# Altium schematic sheet radio.SchDoc
size A4; Organization: Altium Limited; Address1: L3, 12a Rodborough Rd; Address2: Frenchs Forest; Address3: NSW; Address4: Australia 2086; DocumentNumber: 5; SheetNumber: 5; SheetTotal: 7
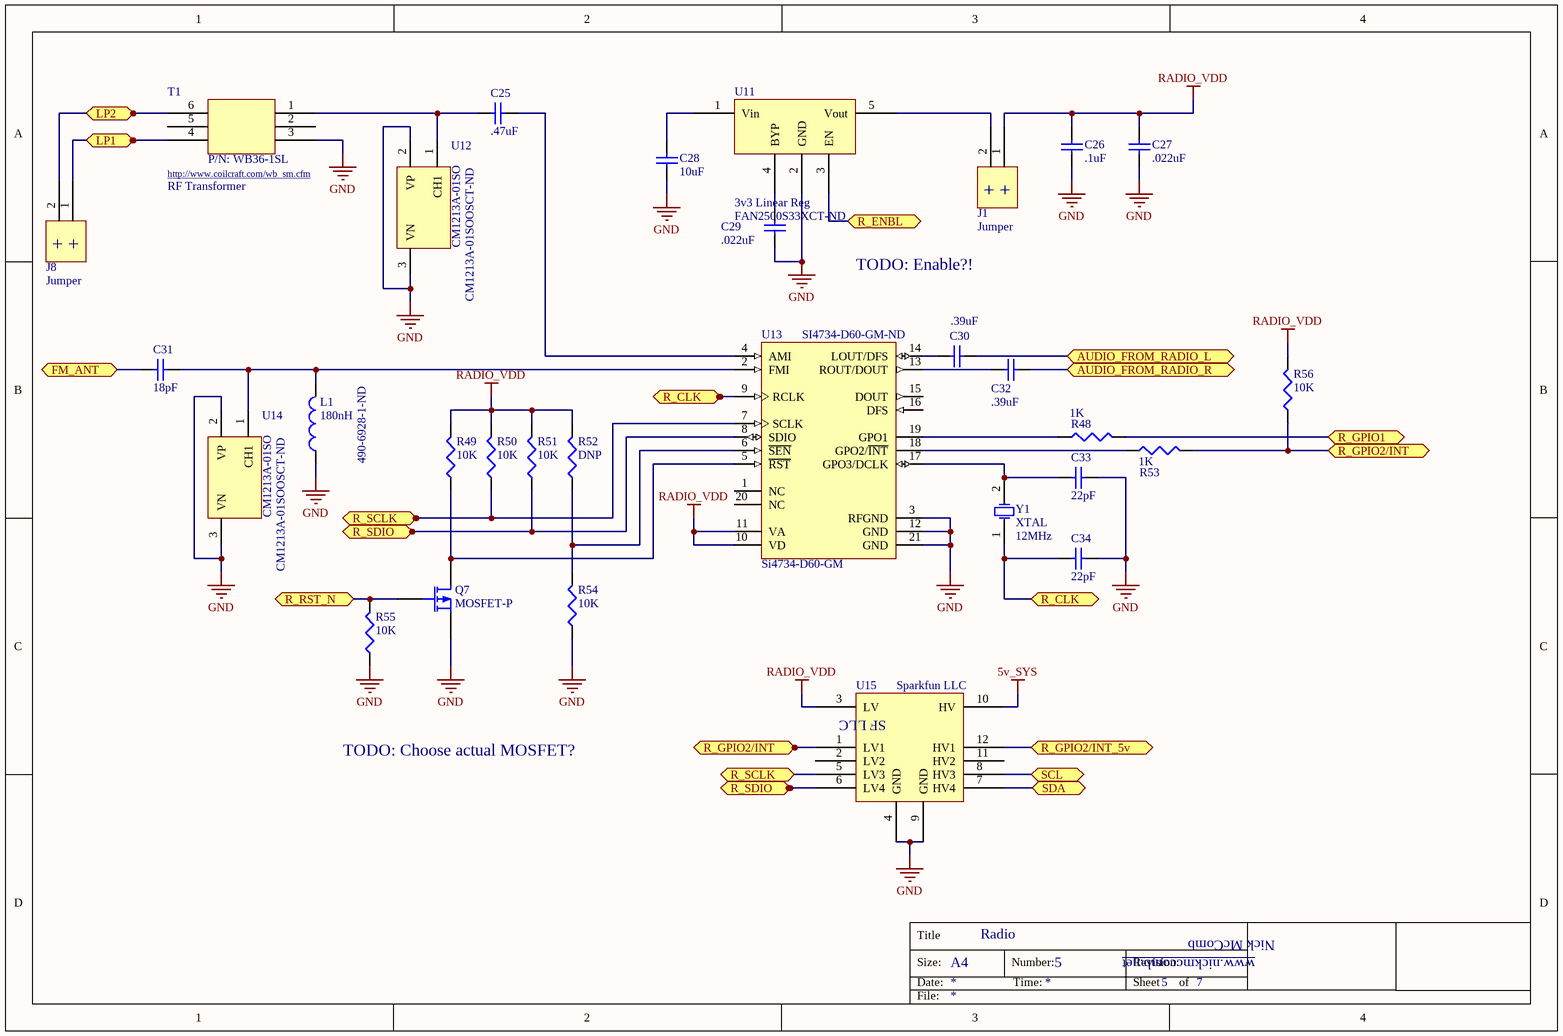
[diagram p0: radio.SchDoc]

## Parts
C25  value .47uF  [C0805]  (hidden comment: 0805 style, by default)
C26  value .1uF  [C0805]  (hidden comment: 0805 style, by default)
C27  value .022uF  [C0805]  (hidden comment: 0805 style, by default)
C28  value 10uF  [C0805]  (hidden comment: 0805 style, by default)
C29  value .022uF  [C0805]  (hidden comment: 0805 style, by default)
C30  value .39uF  [C0805]  (hidden comment: 0805 style, by default)
C31  value 18pF  [C0805]  (hidden comment: 0805 style, by default)
C32  value .39uF  [C0805]  (hidden comment: 0805 style, by default)
C33  value 22pF  [C0805]  (hidden comment: 0805 style, by default)
C34  value 22pF  [C0805]  (hidden comment: 0805 style, by default)
J1  Jumper  [Jumper]
J8  Jumper  [Jumper]
L1  180nH  Supplier Part Number 1: 490-6928-1-ND  [J1-0603]
Q7  MOSFET-P  [E3]
R48  1K  [J1-0603]
R49  10K  [J1-0603]
R50  10K  [J1-0603]
R51  10K  [J1-0603]
R52  DNP  [J1-0603]
R53  1K  [J1-0603]
R54  10K  [J1-0603]
R55  10K  [J1-0603]
R56  10K  [J1-0603]
T1  RF Transformer  [WB Series RF Transformers]
U11  3v3 Linear Reg  Supplier Part Number 1: FAN2500S33XCT-ND  [SOT95P245X110-5N]
U12  CM1213A-01SO  Supplier Part Number 1: CM1213A-01SOOSCT-ND  [ONSC-SOT-23-3-318-08_V]
U13  Si4734-D60-GM  Supplier Part Number 1: SI4734-D60-GM-ND  [SLAB-QFN-20-1700x1700TP_V]
U14  CM1213A-01SO  Supplier Part Number 1: CM1213A-01SOOSCT-ND  [ONSC-SOT-23-3-318-08_V]
U15  Sparkfun LLC  [Sparkfun LLC]
Y1  XTAL  Frequency: 12MHz  [XTAL_PDB]

## Ports
AUDIO_FROM_RADIO_L, AUDIO_FROM_RADIO_R, FM_ANT, LP1, LP2, R_CLK, R_ENBL, R_GPIO1, R_GPIO2/INT, R_GPIO2/INT_5v, R_RST_N, R_SCLK, R_SDIO, SCL, SDA

## Nets
5v_SYS: U15.10(HV)
GND: C26.1 C27.1 C28.1 C29.1 C33.1 C34.1 L1.1 Q7.3(S) R54.1 R55.1 T1.3 U11.2(GND) U12.2(VP) U12.3(VN) U13.3(RFGND) U13.12(GND) U13.21(GND) U14.2(VP) U14.3(VN) U15.4(GND) U15.9(GND)
RADIO_VDD: C26.2 C27.2 J1.1 R49.2 R50.2 R51.2 R52.2 R56.2 U13.10(VD) U13.11(VA) U15.3(LV)
AUDIO_FROM_RADIO_L: C30.2 ; port AUDIO_FROM_RADIO_L
AUDIO_FROM_RADIO_R: C32.2 ; port AUDIO_FROM_RADIO_R
FM_ANT: C31.2 ; port FM_ANT
LP1: J8.1 T1.4 ; port LP1
LP2: J8.2 T1.6 ; port LP2
R_CLK: C34.2 U13.9(RCLK) Y1.1(OSC1) ; port R_CLK
R_ENBL: U11.3(EN) ; port R_ENBL
R_GPIO1: R48.2 ; port R_GPIO1
R_GPIO2/INT: R53.2 R56.1 U15.1(LV1) ; port R_GPIO2/INT
R_GPIO2/INT_5v: U15.12(HV1) ; port R_GPIO2/INT_5v
R_RST_N: Q7.2(G) R55.2 ; port R_RST_N
R_SCLK: R50.1 U13.7(SCLK) U15.5(LV3) ; port R_SCLK
R_SDIO: R51.1 U13.8(SDIO) U15.6(LV4) ; port R_SDIO
SCL: U15.8(HV3) ; port SCL
SDA: U15.7(HV4) ; port SDA
NetC25_1: C25.1 U13.4(AMI)
NetC25_2: C25.2 T1.1 U12.1(CH1)
NetC28_2: C28.2 U11.1(Vin)
NetC29_2: C29.2 U11.4(BYP)
NetC30_1: C30.1 U13.14(LOUT/DFS)
NetC31_1: C31.1 L1.2 U13.2(FMI) U14.1(CH1)
NetC32_1: C32.1 U13.13(ROUT/DOUT)
NetC33_2: C33.2 U13.17(GPO3/DCLK) Y1.2(OSC2)
NetJ1_2: J1.2 U11.5(Vout)
NetQ7_1: Q7.1(D) R49.1 U13.5(~{RST})
NetR48_1: R48.1 U13.19(GPO1)
NetR52_1: R52.1 R54.2 U13.6(~{SEN})
NetR53_1: R53.1 U13.18(GPO2/~{INT})

Not connected (* = marked no-connect by the designer): T1 2 5; U13 1(NC) 15(DOUT) 16(DFS) 20(NC); U15 2(LV2) 11(HV2)

## Notes on the sheet
- TODO: Enable?!
- TODO: Choose actual MOSFET?
- Title
- Size:
- Date:
- A4
- Radio
- Number:
- Time:
- Revision:
- Sheet
- of
- www.nickmccomb.net
- Nick McComb
- File:
- (in symbol Jumper) + +
- (in symbol RF Transformer) P/N: WB36-1SL; http://www.coilcraft.com/wb_sm.cfm
- (in symbol Sparkfun LLC) SF LLC

## Library data of the parts
C25-C34 = Cap: Capacitor; Published: 8-Jun-2000; LatestRevisionDate: 17-Jul-2002; LatestRevisionNote: Re-released for DXP Platform.; PackageReference: RAD-0.3; Publisher: Altium Limited; PackageDescription: Radial Cap, Thru-Hole; 2 Leads; 0.3 in Pin Spacing
L1 = Inductor: Manufacturer: Murata; Manufacturer Part Number: LQW18ANR18J00D; Description: Fixed Inductors 180 NH 5%; Product Training Modules: Inductor Products Chip RF Inductors; Type: Wirewound; Material - Core: Non-Magnetic; Tolerance: ±5%; Current Rating: 140mA; Shielding: Unshielded; DC Resistance (DCR): 2.2 Ohm Max; Q @ Freq: 25 @ 100MHz; Frequency - Self Resonant: 1.3GHz; Frequency - Test: 100MHz; Online Catalog: LQW Series; Other Names: 490-6928-1; Value: 180nH; Supplier 1: Digikey; Stock 1: 2568; Pricing 1: 1=0.17, 10=0.15, 25=0.1352, 50=0.117, 100=0.105, 250=0.0975, 500=0.09, 750=0.0855, 1000=0.078 (USD); Standard Package: 1; Category: Inductors, Coils, Chokes; Family: Fixed Inductors; Series: LQW18A_00; Packaging: Cut Tape (CT); Inductance: 180nH; Operating Temperature: -55°C ~ 125°C; Mounting Type: Surface Mount; Package / Case: 0603 (1608 Metric); Size / Dimension: 0.063" L x 0.031" W (1.60mm x 0.80mm); Height - Seated (Max): 0.039" (1.00mm); ComponentLink1URL: https://datasheet.ciiva.com/6705/l0075s0080lqw18a-00-6705496.pdf; ComponentLink1Description: https://datasheet.ciiva.com/6705/l0075s0080lqw18a-00-6705496.pdf; ComponentLink2URL: https://datasheet.ciiva.com/6705/l0075s0080lqw18a-00-6705498.pdf; ComponentLink2Description: https://datasheet.ciiva.com/6705/l0075s0080lqw18a-00-6705498.pdf; ComponentLink3URL: https://datasheet.ciiva.com/6705/l0075s0080lqw18a-00-6705500.pdf; ComponentLink3Description: https://datasheet.ciiva.com/6705/l0075s0080lqw18a-00-6705500.pdf; ComponentLink4URL: https://datasheet.ciiva.com/11799/0900766b80a002db-11799164.pdf; ComponentLink4Description: https://datasheet.ciiva.com/11799/0900766b80a002db-11799164.pdf
Q7 = MOSFET-P: P-Channel MOSFET; Published: 8-Jun-2000; LatestRevisionDate: 17-Jul-2002; LatestRevisionNote: Re-released for DXP Platform.; PackageVersion: 1995/1996; PackageReference: E3; Publisher: Altium Limited; PackageDescription: TO, Flat Index; 3 In-Line, Axial Leads; Body Dia. 4.6mm; Lead Dia. 0.5 mm (max)
R48-R56 = Res3: Resistor; Published: 8-Jun-2000; LatestRevisionDate: 29-May-2009; LatestRevisionNote: IPC-7351 Footprint Added.; PackageReference: J1-0603; Publisher: Altium Limited; PackageDescription: Chip Resistor
  R48 R53: Value: 1K
  R49-R51 R54-R56: Value: 10K
  R52: Value: DNP
U11 = 3v3 Linear Reg: Manufacturer: Fairchild Semiconductor; Manufacturer Part Number: FAN2500S33X; Dropout Voltage: 140; Max Input Voltage: 6.5; Min Input Voltage: 2.7; Output Voltage: 3.3; Output Current: 100; Outputs: 1; Supplier 1: Digikey; Stock 1: 32735; Pricing 1: 1=0.63, 10=0.557, 100=0.4259, 500=0.3374, 1000=0.2703 (USD); Mount: Surface Mount; Case/Package: SOT-23-5; Pins: 5; Min Operating Temperature: -40; Max Operating Temperature: 125; Package Quantity: 3000; Packaging: Tape and Reel; Max Ouput Current: 100; Nominal Output Voltage: 3.3; Radiation Hardening: No; REACH SVHC: No SVHC; ComponentLink1URL: https://datasheet.ciiva.com/4886/fan2500-192391-4886672.pdf; ComponentLink1Description: https://datasheet.ciiva.com/4886/fan2500-192391-4886672.pdf; ComponentLink2URL: https://datasheet.ciiva.com/8239/fan2501-8239552.pdf; ComponentLink2Description: https://datasheet.ciiva.com/8239/fan2501-8239552.pdf; ComponentLink3URL: https://datasheet.ciiva.com/16747/fan2500-16747543.pdf; ComponentLink3Description: https://datasheet.ciiva.com/16747/fan2500-16747543.pdf; ComponentLink4URL: https://datasheet.ciiva.com/46426/1727616-46426263.pdf; ComponentLink4Description: https://datasheet.ciiva.com/46426/1727616-46426263.pdf; ComponentLink5URL: https://datasheet.ciiva.com/8241/fan2501-8241034.pdf; ComponentLink5Description: https://datasheet.ciiva.com/8241/fan2501-8241034.pdf; ComponentLink6URL: https://datasheet.ciiva.com/2039/fan2500-2039339.pdf; ComponentLink6Description: https://datasheet.ciiva.com/2039/fan2500-2039339.pdf; ComponentLink7URL: https://datasheet.ciiva.com/48696/001252307-da-01-en-ic-reg-ldo-3-3v-fan2500s33x-sot-23-5-fsc-48696763.pdf; ComponentLink7Description: https://datasheet.ciiva.com/48696/001252307-da-01-en-ic-reg-ldo-3-3v-fan2500s33x-sot-23-5-fsc-48696763.pdf; ComponentLink8URL: https://datasheet.ciiva.com/2039/fan2500-2039340.pdf; ComponentLink8Description: https://datasheet.ciiva.com/2039/fan2500-2039340.pdf
U12 U14 = CMP-1063-00149-1: 1-Channel Low Capacitance ESD Protection Array, 3-Pin SOT-23, Pb-Free, Tape and Reel; Manufacturer: On Semiconductor; Number of Lines: 1; Direction: Unidirectional; C Max (pF): 1.2; PPK Max (W): 0.225; Current Rating: 8; ComponentLink3URL: http://www.onsemi.cn/pub_link/Collateral/318-08.PDF; PackageReference: SOT-23-3-318-08; ComponentLink3Description: Package Specification; IR Max (uA): 1; Packing: Tape and Reel; PackageVersion: Rev. AP, 11/2009; DatasheetVersion: Rev. 8; ComponentLink2Description: Datasheet; PackageDescription: 3-Pin Small Outline Transistor, Body 2.92 x 1.3 mm, Pitch 0.95 mm; PartNumber: CM1213A-01SO; Mounting Technology: Surface Mount; ComponentLink2URL: http://www.onsemi.com/pub_link/Collateral/CM1213A.PDF; ComponentLink1URL: http://www.onsemi.com/; ComponentLink1Description: Manufacturer URL; RoHS: Pb-Free; Supplier 1: Digikey; Manufacturer Part Number: CM1213A-01SO; Stock 1: 2764; Pricing 1: 1=0.47, 10=0.4, 100=0.2985, 500=0.2345, 1000=0.1812 (USD); Mount: Surface Mount; Case/Package: TO-236-3; Pins: 3; Min Operating Temperature: -40; Max Operating Temperature: 85; Elements: 1; Capacitance: 1.2; Channels: 1; Package Quantity: 3000; Packaging: Tape and Reel; Length: 3.04; Height: 1.01; Width: 1.4; Radiation Hardening: No; ComponentLink4URL: https://datasheet.ciiva.com/3304/cm1213a-d-3304000.pdf; ComponentLink4Description: https://datasheet.ciiva.com/3304/cm1213a-d-3304000.pdf; ComponentLink5URL: https://datasheet.ciiva.com/6577/cm1213a-d-6577910.pdf; ComponentLink5Description: https://datasheet.ciiva.com/6577/cm1213a-d-6577910.pdf; ComponentLink6URL: https://datasheet.ciiva.com/6577/cm1213a-d-6577911.pdf; ComponentLink6Description: https://datasheet.ciiva.com/6577/cm1213a-d-6577911.pdf; ComponentLink7URL: https://datasheet.ciiva.com/6577/cm1213a-d-6577912.pdf; ComponentLink7Description: https://datasheet.ciiva.com/6577/cm1213a-d-6577912.pdf; ComponentLink8URL: https://datasheet.ciiva.com/11193/cm1213a-d-11193820.pdf; ComponentLink8Description: https://datasheet.ciiva.com/11193/cm1213a-d-11193820.pdf; ComponentLink9URL: https://datasheet.ciiva.com/25958/cm1213a-d-25958253.pdf; ComponentLink9Description: https://datasheet.ciiva.com/25958/cm1213a-d-25958253.pdf; ComponentLink10URL: https://datasheet.ciiva.com/30478/0900766b8121ba52-30478863.pdf; ComponentLink10Description: https://datasheet.ciiva.com/30478/0900766b8121ba52-30478863.pdf
U13 = CMP-0501-00028-1: Broadcast AM / FM / SW / LW Radio Receiver, -20 to 85 degC, 20-pin QFN, Tray; Manufacturer: Silicon Labs; Sub-Family: AM/FM, Shortwave, Longwave, Weather Band Receivers; RDS Support: FALSE; Frequency: 1.71; ComponentLink2Description: Datasheet; ComponentLink1URL: http://www.silabs.com/; PackageDescription: 20-Pin Quad-Flat No-Leads Package, Body 3 x 3 mm, Pitch 0.5 mm; Mounting Technology: Surface Mount; PartNumber: Si4734-D60-GM; ComponentLink2URL: http://www.silabs.com/Support Documents/TechnicalDocs/Si4730-31-34-35-D60.pdf; ComponentLink3Description: Package Specification; ComponentLink3URL: http://www.silabs.com/Support%20Documents/TechnicalDocs/C8051F99x.pdf; PackageReference: QFN-20; ComponentLink1Description: Manufacturer URL; Code_IPC: J-STD-020; DatasheetVersion: Rev. 1.2; Supplier 1: Digikey; Manufacturer Part Number: SI4734-D60-GM; Stock 1: 624; Pricing 1: 1=14.64, 25=14.1024, 100=13.56, 1000=2.4634 (USD); Mount: Surface Mount; Case/Package: QFN; Pins: 20; Min Operating Temperature: -20; Max Operating Temperature: 85; Package Quantity: 490; Packaging: Tray; Radiation Hardening: No; ComponentLink4URL: https://datasheet.ciiva.com/2798/si4730-31-34-35-d60-2798829.pdf; ComponentLink4Description: https://datasheet.ciiva.com/2798/si4730-31-34-35-d60-2798829.pdf; ComponentLink5URL: https://datasheet.ciiva.com/8147/si4730-31-34-35-d60-8147549.pdf; ComponentLink5Description: https://datasheet.ciiva.com/8147/si4730-31-34-35-d60-8147549.pdf
Y1 = XTAL GENERIC: Crystal Oscillator